# EAGLE design XWiFiCPU (EAGLE 6.3)
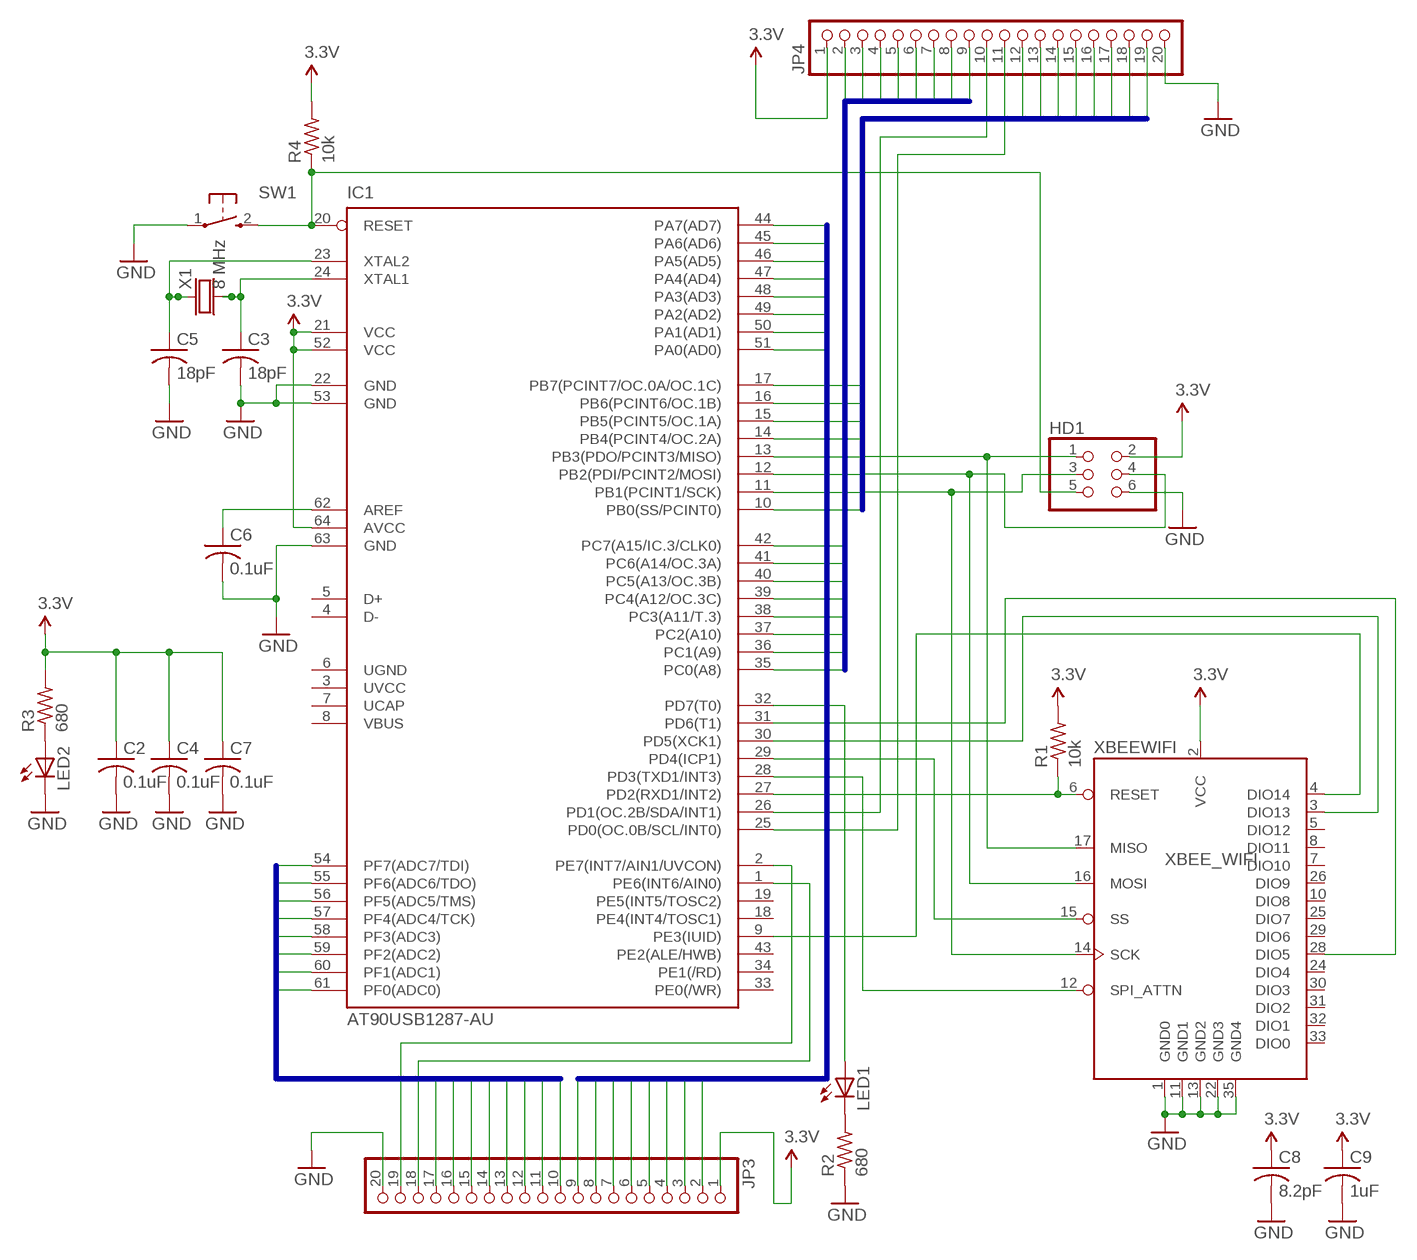
[diagram p0: schematic, sheet 1]

## Parts
C2  0.1uF  0603_CAP  [0603_RESISTOR]
C3  18pF  0603_CAP  [0603_RESISTOR]
C4  0.1uF  0603_CAP  [0603_RESISTOR]
C5  18pF  0603_CAP  [0603_RESISTOR]
C6  0.1uF  0603_CAP  [0603_RESISTOR]
C7  0.1uF  0603_CAP  [0603_RESISTOR]
C8  8.2pF  0603_CAP  [0603_RESISTOR]
C9  1uF  0603_CAP  [0603_RESISTOR]
HD1  HEADER2X3  [HEADER2X3]
IC1  AT90USB1287-AU  [TQFP64]
JP3  PINHD-1X20  [1X20]
JP4  PINHD-1X20  [1X20]
LED1  LEDCHIP-LED0603  [CHIP-LED0603]
LED2  LEDCHIP-LED0603  [CHIP-LED0603]
R1  10k  0603_RESISTOR  [0603_RESISTOR]
R2  680  0603_RESISTOR  [0603_RESISTOR]
R3  680  0603_RESISTOR  [0603_RESISTOR]
R4  10k  0603_RESISTOR  [0603_RESISTOR]
SW1  TAC-SWITCH  [TAC-SWITCH]
X1  8 MHz  CRYSTAL_5X3  [CRYSTAL_5X3]
XBEEWIFI  XBEE_WIFI  [XBEE_WIFI]

## Nets
3.3V: C2.1 C4.1 C7.1 C8.1 C9.1 HD1.2 IC1.21(VCC) IC1.52(VCC) IC1.64(AVCC) JP3.1 JP4.1 R1.2 R3.2 R4.2 XBEEWIFI.2(VCC)
GND: C2.2 C3.2 C4.2 C5.2 C6.2 C7.2 C8.2 C9.2 HD1.6 IC1.22(GND) IC1.53(GND) IC1.63(GND) JP3.20 JP4.20 LED2.C R2.1 SW1.1 XBEEWIFI.1(GND0) XBEEWIFI.11(GND1) XBEEWIFI.13(GND2) XBEEWIFI.22(GND3) XBEEWIFI.35(GND4)
N$1: C5.1 IC1.23(XTAL2) X1.1
N$2: C3.1 IC1.24(XTAL1) X1.2
N$3: LED2.A R3.1
N$4: LED1.C R2.2
N$5: IC1.32(PD7(T0)) LED1.A
N$6: IC1.27(PD2(RXD1/INT2)) R1.1 XBEEWIFI.6(RESET)
N$8: C6.1 IC1.62(AREF)
N$9: IC1.28(PD3(TXD1/INT3)) XBEEWIFI.12(SPI_ATTN)
N$10: IC1.29(PD4(ICP1)) XBEEWIFI.15(SS)
N$11: IC1.30(PD5(XCK1)) XBEEWIFI.3(DIO13)
N$13: IC1.31(PD6(T1)) XBEEWIFI.28(DIO5)
N$16: IC1.9(PE3(IUID)) XBEEWIFI.4(DIO14)
PA0: IC1.51(PA0(AD0)) JP3.9
PA1: IC1.50(PA1(AD1)) JP3.8
PA2: IC1.49(PA2(AD2)) JP3.7
PA3: IC1.48(PA3(AD3)) JP3.6
PA4: IC1.47(PA4(AD4)) JP3.5
PA5: IC1.46(PA5(AD5)) JP3.4
PA6: IC1.45(PA6(AD6)) JP3.3
PA7: IC1.44(PA7(AD7)) JP3.2
PB0: IC1.10(PB0(SS/PCINT0)) JP4.19
PB1: HD1.3 IC1.11(PB1(PCINT1/SCK)) JP4.18 XBEEWIFI.14(SCK)
PB2: HD1.4 IC1.12(PB2(PDI/PCINT2/MOSI)) JP4.17 XBEEWIFI.16(MOSI)
PB3: HD1.1 IC1.13(PB3(PDO/PCINT3/MISO)) JP4.16 XBEEWIFI.17(MISO)
PB4: IC1.14(PB4(PCINT4/OC.2A)) JP4.15
PB5: IC1.15(PB5(PCINT5/OC.1A)) JP4.14
PB6: IC1.16(PB6(PCINT6/OC.1B)) JP4.13
PB7: IC1.17(PB7(PCINT7/OC.0A/OC.1C)) JP4.12
PC0: IC1.35(PC0(A8)) JP4.9
PC1: IC1.36(PC1(A9)) JP4.8
PC2: IC1.37(PC2(A10)) JP4.7
PC3: IC1.38(PC3(A11/T.3)) JP4.6
PC4: IC1.39(PC4(A12/OC.3C)) JP4.5
PC5: IC1.40(PC5(A13/OC.3B)) JP4.4
PC6: IC1.41(PC6(A14/OC.3A)) JP4.3
PC7: IC1.42(PC7(A15/IC.3/CLK0)) JP4.2
PD0: IC1.25(PD0(OC.0B/SCL/INT0)) JP4.11
PD1: IC1.26(PD1(OC.2B/SDA/INT1)) JP4.10
PE6: IC1.1(PE6(INT6/AIN0)) JP3.18
PE7: IC1.2(PE7(INT7/AIN1/UVCON)) JP3.19
PF0: IC1.61(PF0(ADC0)) JP3.17
PF1: IC1.60(PF1(ADC1)) JP3.16
PF2: IC1.59(PF2(ADC2)) JP3.15
PF3: IC1.58(PF3(ADC3)) JP3.14
PF4: IC1.57(PF4(ADC4/TCK)) JP3.13
PF5: IC1.56(PF5(ADC5/TMS)) JP3.12
PF6: IC1.55(PF6(ADC6/TDO)) JP3.11
PF7: IC1.54(PF7(ADC7/TDI)) JP3.10
RESET: HD1.5 IC1.20(RESET) R4.1 SW1.2
Unconnected: IC1.4(D-) IC1.5(D+) IC1.18(PE4(INT4/TOSC1)) IC1.19(PE5(INT5/TOSC2)) IC1.33(PE0(/WR)) IC1.34(PE1(/RD)) IC1.43(PE2(ALE/HWB)) XBEEWIFI.5(DIO12) XBEEWIFI.7(DIO10) XBEEWIFI.8(DIO11) XBEEWIFI.10(DIO8) XBEEWIFI.24(DIO4) XBEEWIFI.25(DIO7) XBEEWIFI.26(DIO9) XBEEWIFI.29(DIO6) XBEEWIFI.30(DIO3) XBEEWIFI.31(DIO2) XBEEWIFI.32(DIO1) XBEEWIFI.33(DIO0)

## Buses
PA[0..7]
PF[0..7]
PC[0..7]
PB[0..7]

## Power pins joined to a net without a drawn wire
UCAP: IC1.7(UCAP)
UGND: IC1.6(UGND)
UVCC: IC1.3(UVCC)
VBUS: IC1.8(VBUS)

## Library data of the parts
C2-C9 = jkf-parts:0603_CAP: 0603 Capacitor
HD1 = jkf-parts:HEADER2X3
IC1 = at90usb:AT90USB1287-*: Atmel AT90USB1287 AVR Microcontroller with USB Interface and 128kB Flash Memory
JP3 JP4 = pinhead:PINHD-1X20: PIN HEADER
LED1 LED2 = adafruit:LED: LED OSRAM: - CHIPLED LG R971, LG N971, LY N971, LG Q971, LY Q971, LO R971, LY R971 LH N974, LH R974 LS Q976, LO Q976, LY Q976 LO Q996 - Hyper CHIPLED LW Q18S LB Q993, LB Q99A, LB R99A - SideLED LS A670, LO A670, LY A670, LG A670, LP A670 LB A673, LV A673, LT A673, LW A673 LH A674 LY A675 LS A676, LA A676, LO A676, LY A676, LW A676 LS A679, LY A679, LG A679 - Hyper Micro SIDELED® LS Y876, LA Y876, LO Y876, LY Y876 LT Y87S - SmartLED LW L88C, LW L88S LB L89C, LB L89S, LG L890 LS L89K, LO L89K, LY L89K LS L896, LA L896, LO L896, LY L896 - TOPLED LS T670, LO T670, LY T670, LG T670, LP T670 LSG T670, LSP T670, LSY T670, LOP T670, LYG T670 LG T671, LOG T671, LSG T671 LB T673, LV T673, LT T673, LW T673 LH T674 LS T676, LA T676, LO T676, LY T676, LB T676, LH T676, LSB T676, LW T676 LB T67C, LV T67C, LT T67C, LS T67K, LO T67K, LY T67K, LW E67C LS E67B, LA E67B, LO E67B, LY E67B, LB E67C, LV E67C, LT E67C LW T67C LS T679, LY T679, LG T679 LS T770, LO T770, LY T770, LG T770, LP T770 LB T773, LV T773, LT T773, LW T773 LH T774 LS E675, LA E675, LY E675, LS T675 LS T776, LA T776, LO T776, LY T776, LB T776 LHGB T686 LT T68C, LB T68C - Hyper Mini TOPLED® LB M676 - Mini TOPLED Santana® LG M470 LS M47K, LO M47K, LY M47K Source: http://www.osram.convergy.de/
R1-R4 = jkf-parts:0603_RESISTOR
SW1 = jkf-parts:TAC-SWITCH
X1 = jkf-parts:CRYSTAL_5X3: Crystal 5mm x 3mm
XBEEWIFI = jkf:XBEE_WIFI

## Board
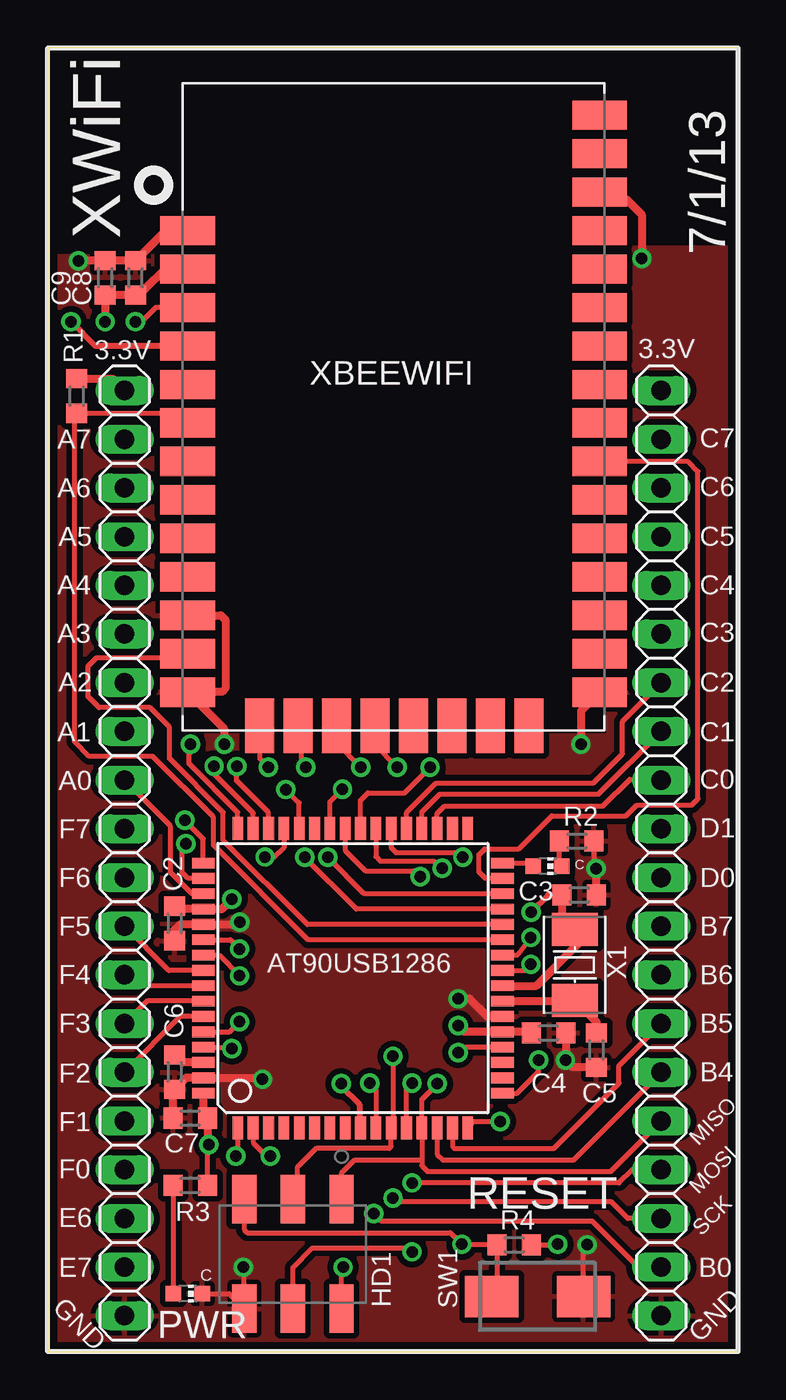
[diagram p1: board, top side]
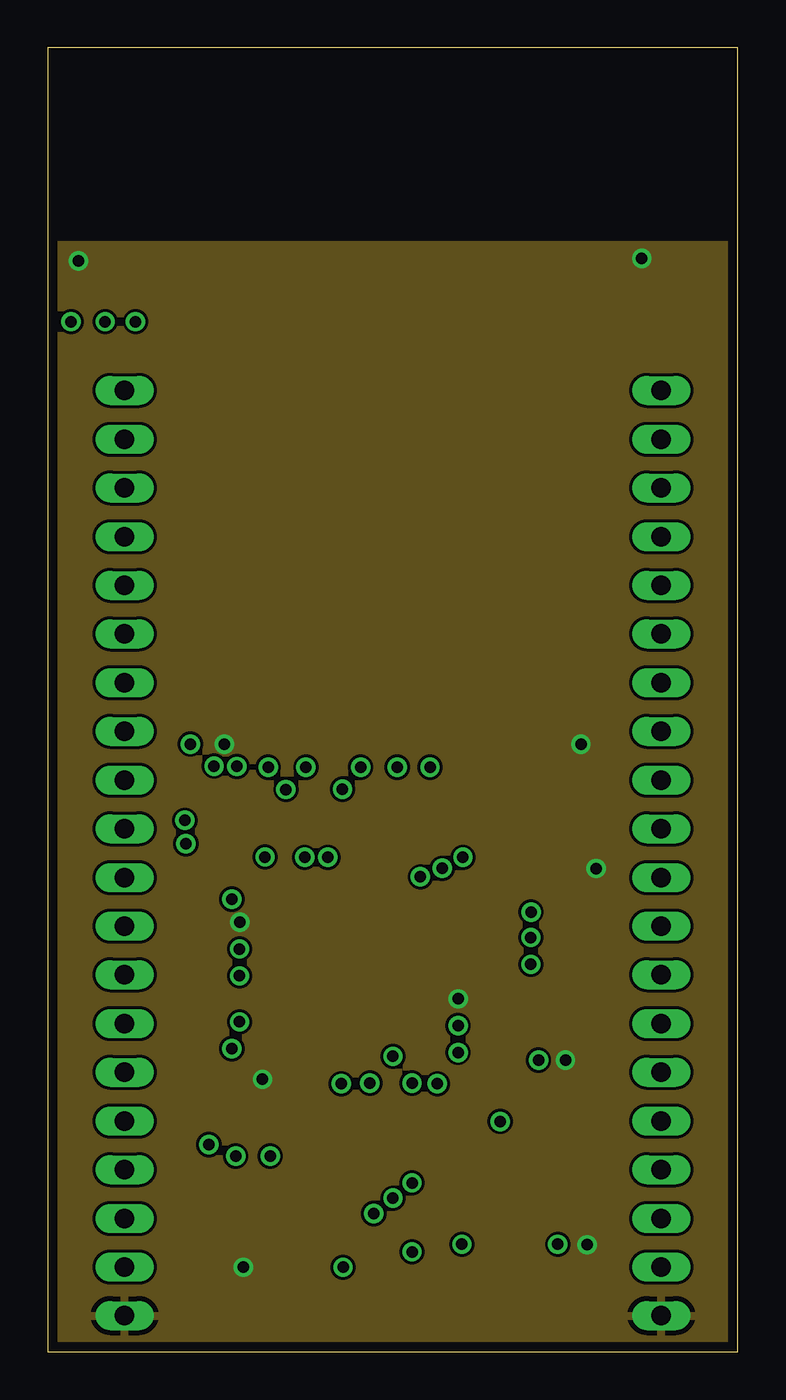
[diagram p2: board, inner layer GND]
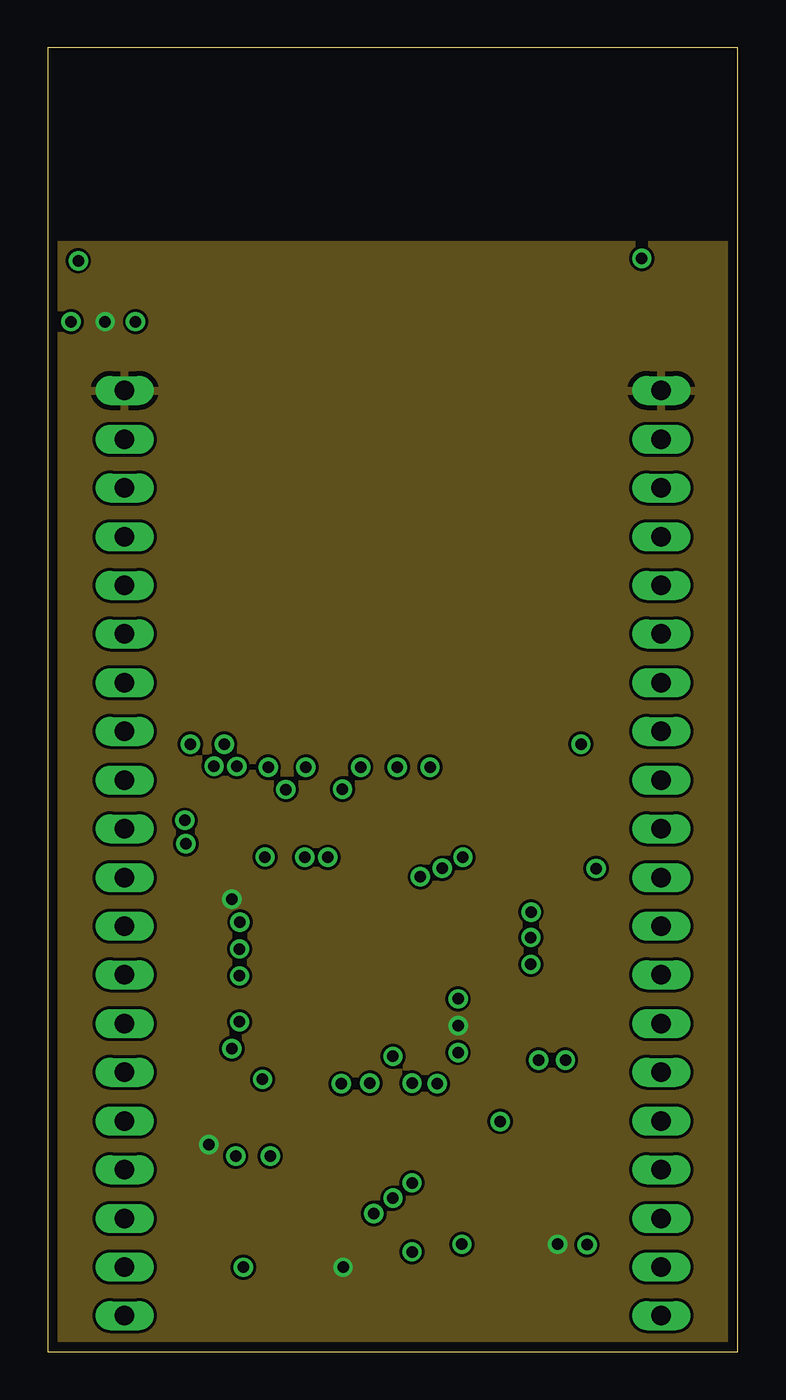
[diagram p3: board, inner layer 3.3V]
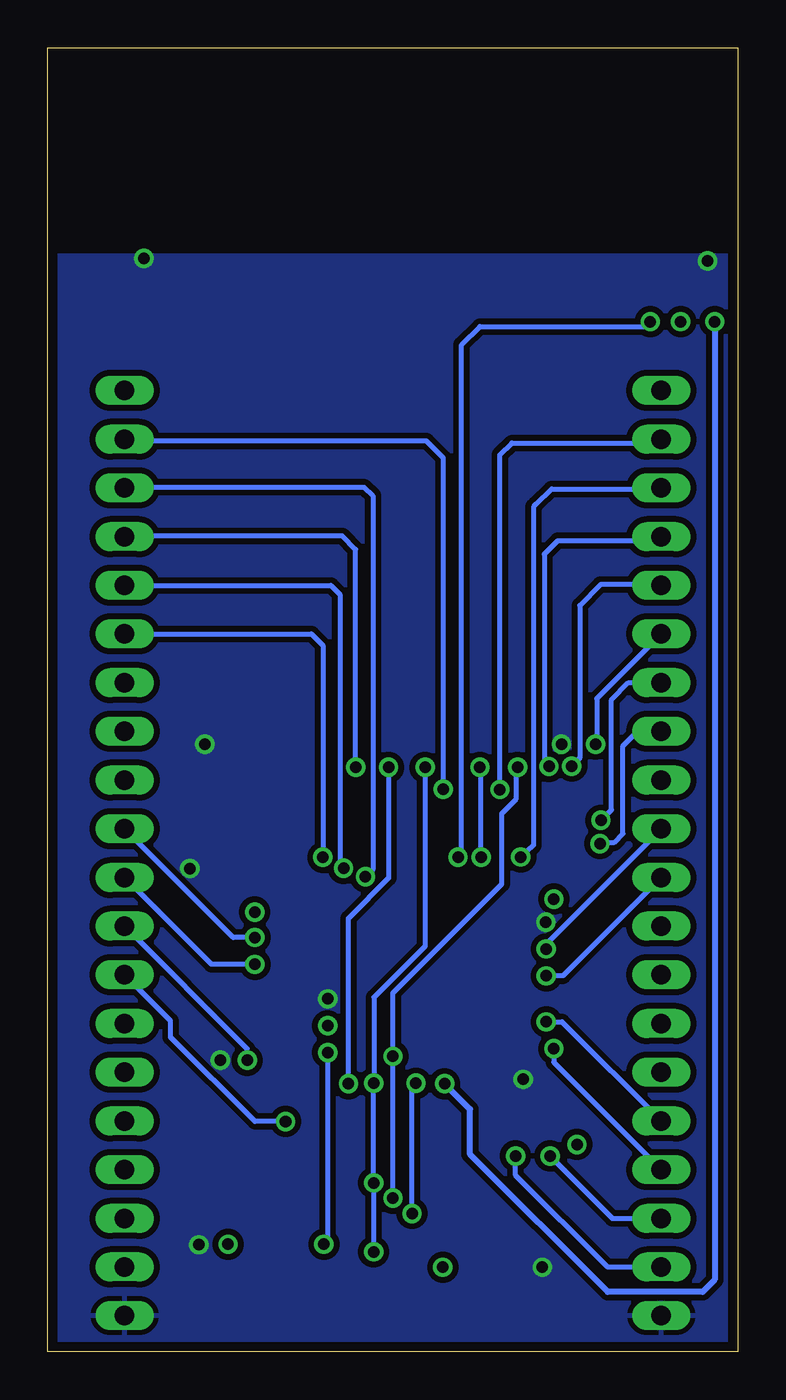
[diagram p4: board, bottom side, seen from below]

Size 36 x 68 mm. Coordinates in mm from the lower left corner, seen from the top.
Outline: 0,0 36,0 36,68 0,68 0,0
Copper layers (1+2*15+16): Top 0.0178mm / dielectric 12mil / GND 0.0356mm / dielectric 28mil / 3.3V 0.0356mm / dielectric 12mil / Bottom 0.0178mm
Design rules "SSC-EAGLE-4Lyr_v1.0.0.3": minimum track width 6mil, minimum drill 8mil, track to track 6mil, track to pad 6mil, pad to pad 6mil, via to via 6mil, smd to smd 6mil, copper to edge 20mil, drill to drill 16mil, minimum pad ring 8mil, minimum via ring 8mil, stop-mask expansion 3mil, vias tented up to drill 0mil, thermal gap 10mil

### Footprints (pad centres in the part's own frame; a part is rotated, then mirrored left to right if it is on the bottom)
0603_RESISTOR = smd 1 x 1.1: 1 -0.9,0; 2 0.9,0
HEADER2X3 = smd 2.54 x 1.27: 1 -3.175,2.54; 2 2.54,2.54; 3 -3.175,0; 4 2.54,0; 5 -3.175,-2.54; 6 2.54,-2.54
TQFP64 = smd 1.194 x 0.559: 1 -7.8,6; 2 -7.8,5.2; 3 -7.8,4.4; 4 -7.8,3.6; 5 -7.8,2.8; 6 -7.8,2; 7 -7.8,1.2; 8 -7.8,0.4; 9 -7.8,-0.4; 10 -7.8,-1.2; 11 -7.8,-2; 12 -7.8,-2.8; 13 -7.8,-3.6; 14 -7.8,-4.4; 15 -7.8,-5.2; 16 -7.8,-6; 33 7.8,-6; 34 7.8,-5.2; 35 7.8,-4.4; 36 7.8,-3.6; 37 7.8,-2.8; 38 7.8,-2; 39 7.8,-1.2; 40 7.8,-0.4; 41 7.8,0.4; 42 7.8,1.2; 43 7.8,2; 44 7.8,2.8; 45 7.8,3.6; 46 7.8,4.4; 47 7.8,5.2; 48 7.8,6 | smd 0.559 x 1.194: 17 -6,-7.8; 18 -5.2,-7.8; 19 -4.4,-7.8; 20 -3.6,-7.8; 21 -2.8,-7.8; 22 -2,-7.8; 23 -1.2,-7.8; 24 -0.4,-7.8; 25 0.4,-7.8; 26 1.2,-7.8; 27 2,-7.8; 28 2.8,-7.8; 29 3.6,-7.8; 30 4.4,-7.8; 31 5.2,-7.8; 32 6,-7.8; 49 6,7.8; 50 5.2,7.8; 51 4.4,7.8; 52 3.6,7.8; 53 2.8,7.8; 54 2,7.8; 55 1.2,7.8; 56 0.4,7.8; 57 -0.4,7.8; 58 -1.2,7.8; 59 -2,7.8; 60 -2.8,7.8; 61 -3.6,7.8; 62 -4.4,7.8; 63 -5.2,7.8; 64 -6,7.8
1X20 = drill 1.016 long: 1 -24.13,0; 2 -21.59,0; 3 -19.05,0; 4 -16.51,0; 5 -13.97,0; 6 -11.43,0; 7 -8.89,0; 8 -6.35,0; 9 -3.81,0; 10 -1.27,0; 11 1.27,0; 12 3.81,0; 13 6.35,0; 14 8.89,0; 15 11.43,0; 16 13.97,0; 17 16.51,0; 18 19.05,0; 19 21.59,0; 20 24.13,0
CHIP-LED0603 = smd 0.8 x 0.8: A 0,-0.75; C 0,0.75
TAC-SWITCH = smd 2.8 x 2.16: 1 1.4,1.08; 2 6.2,1.08
CRYSTAL_5X3 = smd 1.7 x 2.4: 1 -1.85,0; 2 1.85,0
XBEE_WIFI = smd 2.845 x 1.524: 1 -10.744,9.195; 2 -10.744,7.188; 3 -10.744,5.182; 4 -10.744,3.175; 5 -10.744,1.168; 6 -10.744,-0.838; 7 -10.744,-2.845; 8 -10.744,-4.851; 9 -10.744,-6.858; 10 -10.744,-8.865; 11 -10.744,-10.871; 12 -10.744,-12.878; 13 -10.744,-14.884; 22 10.744,-14.884; 23 10.744,-12.878; 24 10.744,-10.871; 25 10.744,-8.865; 26 10.744,-6.858; 27 10.744,-4.851; 28 10.744,-2.845; 29 10.744,-0.838; 30 10.744,1.168; 31 10.744,3.175; 32 10.744,5.182; 33 10.744,7.188; 34 10.744,9.195; 35 10.744,11.201; 36 10.744,13.208; 37 10.744,15.215 | smd 1.524 x 2.845: 14 -6.985,-16.637; 15 -4.978,-16.637; 16 -2.972,-16.637; 17 -0.965,-16.637; 18 1.041,-16.637; 19 3.048,-16.637; 20 5.055,-16.637; 21 7.061,-16.637

### Placement (x,y rotation side)
C2  6.62,22.33 270 top
C3  27.72,23.82 0 top
C4  26.12,16.62 0 top
C5  28.62,15.73 270 top
C6  6.62,14.58 270 top
C7  7.43,12.18 180 top
C8  4.57,56.01 90 top
C9  2.98,56.01 90 top
HD1  12.78,4.78 270 top
IC1  15.91,19.48 90 top
JP3  4,26 270 top
JP4  32,26 270 top
LED1  26.07,25.32 270 top
LED2  7.3,3.02 270 top
R1  1.5,49.84 90 top
R2  27.59,26.63 180 top
R3  7.43,8.67 0 top
R4  24.33,5.57 0 top
SW1  29.35,3.96 180 top
X1  27.49,20.17 90 top
XBEEWIFI  18.03,49.28 0 top

### Tracks (layer width: path | path; a pad name or v marks a point on that pad's centre or on a via)
3.3V  (via drill 0.6)
  Top 0.254: 25.16,16.68 C4.1 | HD1.2 15.32,4.32 v15.4,4.4 | R4.2 26.57,5.57 v26.6,5.6 | R3.2 8.33,10.73 v8.4,10.8
  Top 0.406: 25.16,16.68 IC1.21 21.72,16.68 v21.4,17 | IC1.64 8.11,12.4 C7.1 8.33,10.87 v8.4,10.8 v8.39,10.79 | C2.1 6.77,23.08 IC1.52 9.08,23.08 v9.6,23.6 | R1.2 3.39,50.74 JP3.1 | XBEEWIFI.2 6.11,56.46 5.08,55.44 4.9,55.44 C8.1 C9.1 v2.98,53.72
  pour 3.3V: -1,57.73 37,57.73 37,-1 -1.2,-1
GND  (via drill 0.6)
  Top 0.254: v10.2,4.4 10.24,4.36 HD1.6 9.46,3.02 LED2.C | R2.1 28.49,25.31 v28.6,25.2 | SW1.1 27.95,5.39 v28.13,5.57
  Top 0.406: IC1.22 22.92,17.48 22,18.4 v21.4,18.4 | C4.2 27.02,15.22 v27,15.2 27.37,14.83 C5.2 | C3.2 28.62,25.18 v28.6,25.2 | C7.2 6.53,13.59 C6.2 7.22,14.28 IC1.63 11.12,14.28 v11.2,14.2 | C2.2 6.6,21.45 6.6,22 6.88,22.28 IC1.53 9.9,22.28 v10.02,22.4 | XBEEWIFI.35 30.2,60.1 30.99,59.31 v30.99,57.02 | XBEEWIFI.22 27.81,33.43 v27.81,31.69 | XBEEWIFI.1 6.14,58.47 C8.2 C9.2 v1.6,56.91 v1.59,56.9 | XBEEWIFI.11 9.03,38.41 9.27,38.16 9.27,34.61 9.08,34.42 7.32,34.42 XBEEWIFI.13 9.21,32.47 v9.21,31.69
  pour GND: -1,57.73 37,57.73 37,-1 -1.2,-1
  pour Bottom (isolate 0.305): -1.27,57.15 36.83,57.15 36.83,-1.27 -1.27,-1.27
  pour Top (isolate 0.305): 0,57.15 6.6,57.15 6.6,32.13 29.27,32.13 29.27,57.59 36.83,57.59 36.83,57.15 36.83,-1.27 0,-1.27
N$1
  Top 0.406: IC1.23 27.45,18.28 X1.1 28.62,17.19 C5.1
N$2
  Top 0.305: C3.1 26.11,23.82 25.21,22.92
  Top 0.406: IC1.24 25.48,19.08 27.6,21.2 27.6,21.91 X1.2 26.82,22.69 C3.1
N$3
  Top 0.254: LED2.A 6.55,8.64 R3.1
N$4
  Top 0.254: LED1.C 26.69,25.32 R2.2
N$5
  Top 0.254: IC1.32 25.32,25.48 LED1.A
N$6
  Top 0.254: IC1.27 13.57,21.48 8.64,26.42 8.64,27.88 5.46,31.05 2.16,31.05 1.4,31.81 1.4,48.84 R1.1 6.79,48.94 XBEEWIFI.6
N$8
  Top 0.406: IC1.62 7.02,15.08 C6.1
N$9
  Top 0.254: IC1.28 13.53,22.28 9.14,26.67 9.14,28.13 6.35,30.92 6.35,32.58 5.33,33.59 2.67,33.59 2.1,34.16 2.1,35.75 2.54,36.2 7.09,36.2 XBEEWIFI.12
N$10  (via drill 0.6)
  Top 0.254: XBEEWIFI.15 13.21,32.11 13.21,30.73 v13.46,30.48 | IC1.29 16.1,23.08 v13.4,25.78
  Bottom 0.254: v13.4,25.78 13.4,30.42 v13.46,30.48
N$11  (via drill 0.6)
  Top 0.254: XBEEWIFI.3 5.63,54.46 4.89,53.72 v4.57,53.72 | IC1.30 16.51,23.88 v14.61,25.78
  Bottom 0.254: v4.57,53.72 4.83,53.47 13.46,53.47 14.41,52.51 14.41,25.97 v14.61,25.78
N$13
  Top 0.254: IC1.31 22.82,24.68 22.48,25.02 22.48,25.91 22.8,26.23 24.57,26.23 26.29,27.94 30.16,27.94 30.73,28.51 33.59,28.51 33.91,28.83 33.91,45.91 33.4,46.42 28.79,46.42 XBEEWIFI.28
N$16  (via drill 0.6)
  Top 0.305: XBEEWIFI.4 2.48,52.45 v1.21,53.72 | v15.3,13.97 15.3,13.84 16.26,12.89 16.26,11.73 IC1.9
  Bottom 0.305: v1.21,53.72 1.21,3.75 1.84,3.11 6.79,3.11 13.97,10.29 13.97,12.64 v15.3,13.97
N$17  (via drill 0.6)
  other vias: 25.21,22.92
PA0
  Top 0.254: IC1.51 7.52,23.88 6.4,25 6.4,27.41 JP3.9
PA1  (via drill 0.6)
  Top 0.254: IC1.50 7.32,24.68 7,25 7,26.29 v7.2,26.49
  Bottom 0.254: JP3.8 5.25,32.35 6,31.6 6,27.02 6.48,26.54 7.15,26.54 v7.2,26.49
PA2  (via drill 0.6)
  Top 0.254: IC1.49 8.11,26.75 v7.15,27.71
  Bottom 0.254: JP3.7 5.71,34.89 6.6,34 6.6,28.26 v7.15,27.71
PA3  (via drill 0.6)
  Top 0.254: IC1.48 9.91,28.13 7.37,30.67 7.37,31.62 v7.43,31.69
  Bottom 0.254: JP3.6 7.37,34.06 7.37,31.75 v7.43,31.69
PA4  (via drill 0.6)
  Top 0.254: IC1.47 10.71,28.09 10,28.8 8.67,30.13 v8.67,30.54
  Bottom 0.254: JP3.5 4.03,40 7.18,40 8.26,38.92 8.26,30.95 v8.67,30.54
PA5  (via drill 0.6)
  Top 0.254: IC1.46 11.51,28.11 9.84,29.78 9.84,30.51 v9.86,30.52
  Bottom 0.254: JP3.4 4.22,42.29 9.4,42.29 10.1,41.59 10.1,30.76 v9.86,30.52
PA6  (via drill 0.6)
  Top 0.254: IC1.45 12.31,26.28 11.81,25.78 11.35,25.78 v11.33,25.8
  Bottom 0.254: JP3.3 4.05,45 9.73,45 10.53,44.2 10.54,44.2 10.67,44.07 10.67,26.41 v11.33,25.8
PA7  (via drill 0.6)
  Top 0.254: IC1.44 13.11,28.63 v12.42,29.32
  Bottom 0.254: JP3.2 4.19,47.4 11.8,47.4 12.42,46.78 v12.42,29.32
PB0  (via drill 0.6)
  Top 0.254: JP4.19 30.79,4.41 28.4,6.8 17.4,6.8 v17,7.2 | v16.8,14 17.11,13.69 IC1.10
  Bottom 0.254: v17,7.2 17,13.8 v16.8,14
PB1  (via drill 0.6)
  Top 0.254: HD1.3 13,8.18 13,9.6 14,10.6 17.8,10.6 17.91,10.71 IC1.11 18,11.77 v18,15.4 | JP4.18 30.25,6.95 29.4,7.8 18.2,7.8 v18,8 | XBEEWIFI.14 11.05,30.92 v11.49,30.48
  Bottom 0.254: v18,8 v18,15.4 18,18.7 12.32,24.38 12.32,28.07 11.56,28.83 11.56,30.42 v11.49,30.48
PB2  (via drill 0.6)
  Top 0.254: HD1.4 12.78,4.38 13.8,5.4 18.8,5.4 v19,5.2 | JP4.17 30.49,9.49 29.8,8.8 v19,8.8 | IC1.12 18.71,13.71 v19,14 | XBEEWIFI.16 15.06,31.74 v16.32,30.48
  Bottom 0.254: v19,5.2 v19,8.8 v19,14 18.99,14.01 18.99,18.48 16.32,21.14 v16.32,30.48
PB3  (via drill 0.6)
  Top 0.254: 19.51,10 IC1.13 19.51,13.16 v20.32,13.97 | 19.51,10 19.51,9.69 19.8,9.4 29.37,9.4 JP4.16 | HD1.1 15.32,9.32 16,10 19.51,10 | XBEEWIFI.17 17.07,31.64 v18.22,30.48
  Bottom 0.254: v20.32,13.97 20.32,22.61 18.22,24.7 v18.22,30.48
PB4
  Top 0.254: IC1.14 20.31,10.29 20.6,10 27.43,10 JP4.15
PB5
  Top 0.254: IC1.15 21.11,10.69 21.2,10.6 26.4,10.6 29.8,14 29.8,14.91 JP4.14
PB6  (via drill 0.6)
  Top 0.254: IC1.16 22.23,12 v23.6,12
  Bottom 0.254: v23.6,12 25.2,12 29.6,16.4 29.6,17.25 JP4.13
PB7  (via drill 0.6)
  Top 0.254: IC1.17 24.48,13.48 25.6,14.6 v25.6,15.2
  Bottom 0.254: v25.6,15.2 25.6,15.79 JP4.12
PC0
  Top 0.254: IC1.35 20.31,28.06 20.7,28.45 28.96,28.45 30.35,29.84 31.96,29.84 JP4.9
PC1
  Top 0.254: IC1.36 19.51,28.15 20.45,29.08 28.73,29.08 JP4.8
PC2
  Top 0.254: IC1.37 18.71,28.11 20.26,29.65 28.45,29.65 29.97,31.18 29.97,32.86 JP4.7
PC3  (via drill 0.6)
  Top 0.254: IC1.38 17.91,26.29 18.16,26.04 21.4,26.04 v21.65,25.78
  Bottom 0.254: 31.96,37.47 JP4.6 22.25,37.43 21.65,36.83 v21.65,25.78
PC4  (via drill 0.6)
  Top 0.254: IC1.39 17.11,25.82 17.34,25.59 20.13,25.59 20.51,25.21 v20.57,25.21
  Bottom 0.254: 31.96,40.01 JP4.5 21.24,39.97 20.77,39.5 20.77,25.4 v20.57,25.21
PC5  (via drill 0.6)
  Top 0.254: IC1.40 16.31,28.76 16.7,29.15 18.61,29.15 v19.94,30.48
  Bottom 0.254: v19.94,30.48 19.94,41.85 20.64,42.55 31.96,42.55 JP4.4
PC6  (via drill 0.6)
  Top 0.254: IC1.41 15.51,26.15 16.57,25.08 19.11,25.08 v19.43,24.77
  Bottom 0.254: JP4.3 31.96,45.09 19.49,45.09 19.05,44.64 19.05,25.15 v19.43,24.77
PC7  (via drill 0.6)
  Top 0.254: IC1.42 14.71,28.68 v15.37,29.34
  Bottom 0.254: JP4.2 31.91,47.5 16.26,47.5 15.37,46.61 v15.37,29.34
PD0  (via drill 0.6)
  Top 0.254: IC1.25 24.88,19.88 v25.2,20.2
  Bottom 0.254: v25.2,20.2 27.47,20.2 JP4.11
PD1  (via drill 0.6)
  Top 0.254: IC1.26 24.48,20.68 24.6,20.8 v25.2,21.6
  Bottom 0.254: v25.2,21.6 26.33,21.6 JP4.10
PE6  (via drill 0.6)
  Top 0.254: IC1.1 9.91,10.31 v9.8,10.2
  Bottom 0.254: v9.8,10.2 6.55,6.95 JP3.18
PE7  (via drill 0.6)
  Top 0.254: IC1.2 10.71,10.89 11.2,10.4 11.4,10.4 v11.6,10.2
  Bottom 0.254: JP3.19 6.81,4.41 11.6,9.2 v11.6,10.2
PF0  (via drill 0.6)
  Top 0.254: IC1.61 9.52,15.88 v9.6,15.8
  Bottom 0.254: v9.6,15.8 9.6,15.09 JP3.17
PF1  (via drill 0.6)
  Top 0.254: IC1.60 9.48,16.68 v10,17.2
  Bottom 0.254: v10,17.2 9.17,17.2 JP3.16
PF2
  Top 0.254: IC1.59 6.91,17.48 JP3.15
PF3
  Top 0.254: IC1.58 5.17,18.28 JP3.14
PF4
  Top 0.254: IC1.57 4.57,19.08 JP3.13
PF5
  Top 0.254: IC1.56 6.31,19.88 JP3.12
PF6  (via drill 0.6)
  Top 0.254: IC1.55 8.92,20.68 v10,19.6
  Bottom 0.254: JP3.11 9.13,19.6 v10,19.6
PF7  (via drill 0.6)
  Top 0.254: IC1.54 9.52,21.48 v10,21
  Bottom 0.254: JP3.10 10,21.27 v10,21
RESET  (via drill 0.6)
  Top 0.254: SW1.2 23.43,3.16 R4.1 23.4,5.6 v21.6,5.6 21,6.2 10.4,6.2 10.24,6.36 HD1.5 10.2,7.92 | IC1.20 21.68,15.88 v21.4,15.6
  Bottom 0.254: v21.4,15.6 21.4,5.8 v21.6,5.6

### Text on the board
tPlace: C | AT90USB1286 | C
tSilk: XWiFi | 7/1/13 | 3.3V | 3.3V | A7 | C7 | A6 | C6 | A5 | C5 | A4 | C4 | A3 | C3 | A2 | C2 | A1 | C1 | A0 | C0 | F7 | D1 | F6 | D0 | F5 | B7 | F4 | B6 | F3 | B5 | F2 | B4 | F1 | MISO | F0 | MOSI | RESET | E6 | SCK | E7 | B0 | GND | PWR | GND